# Altium schematic sheet 26 Clock 1.SchDoc
size 297 x 209 mm
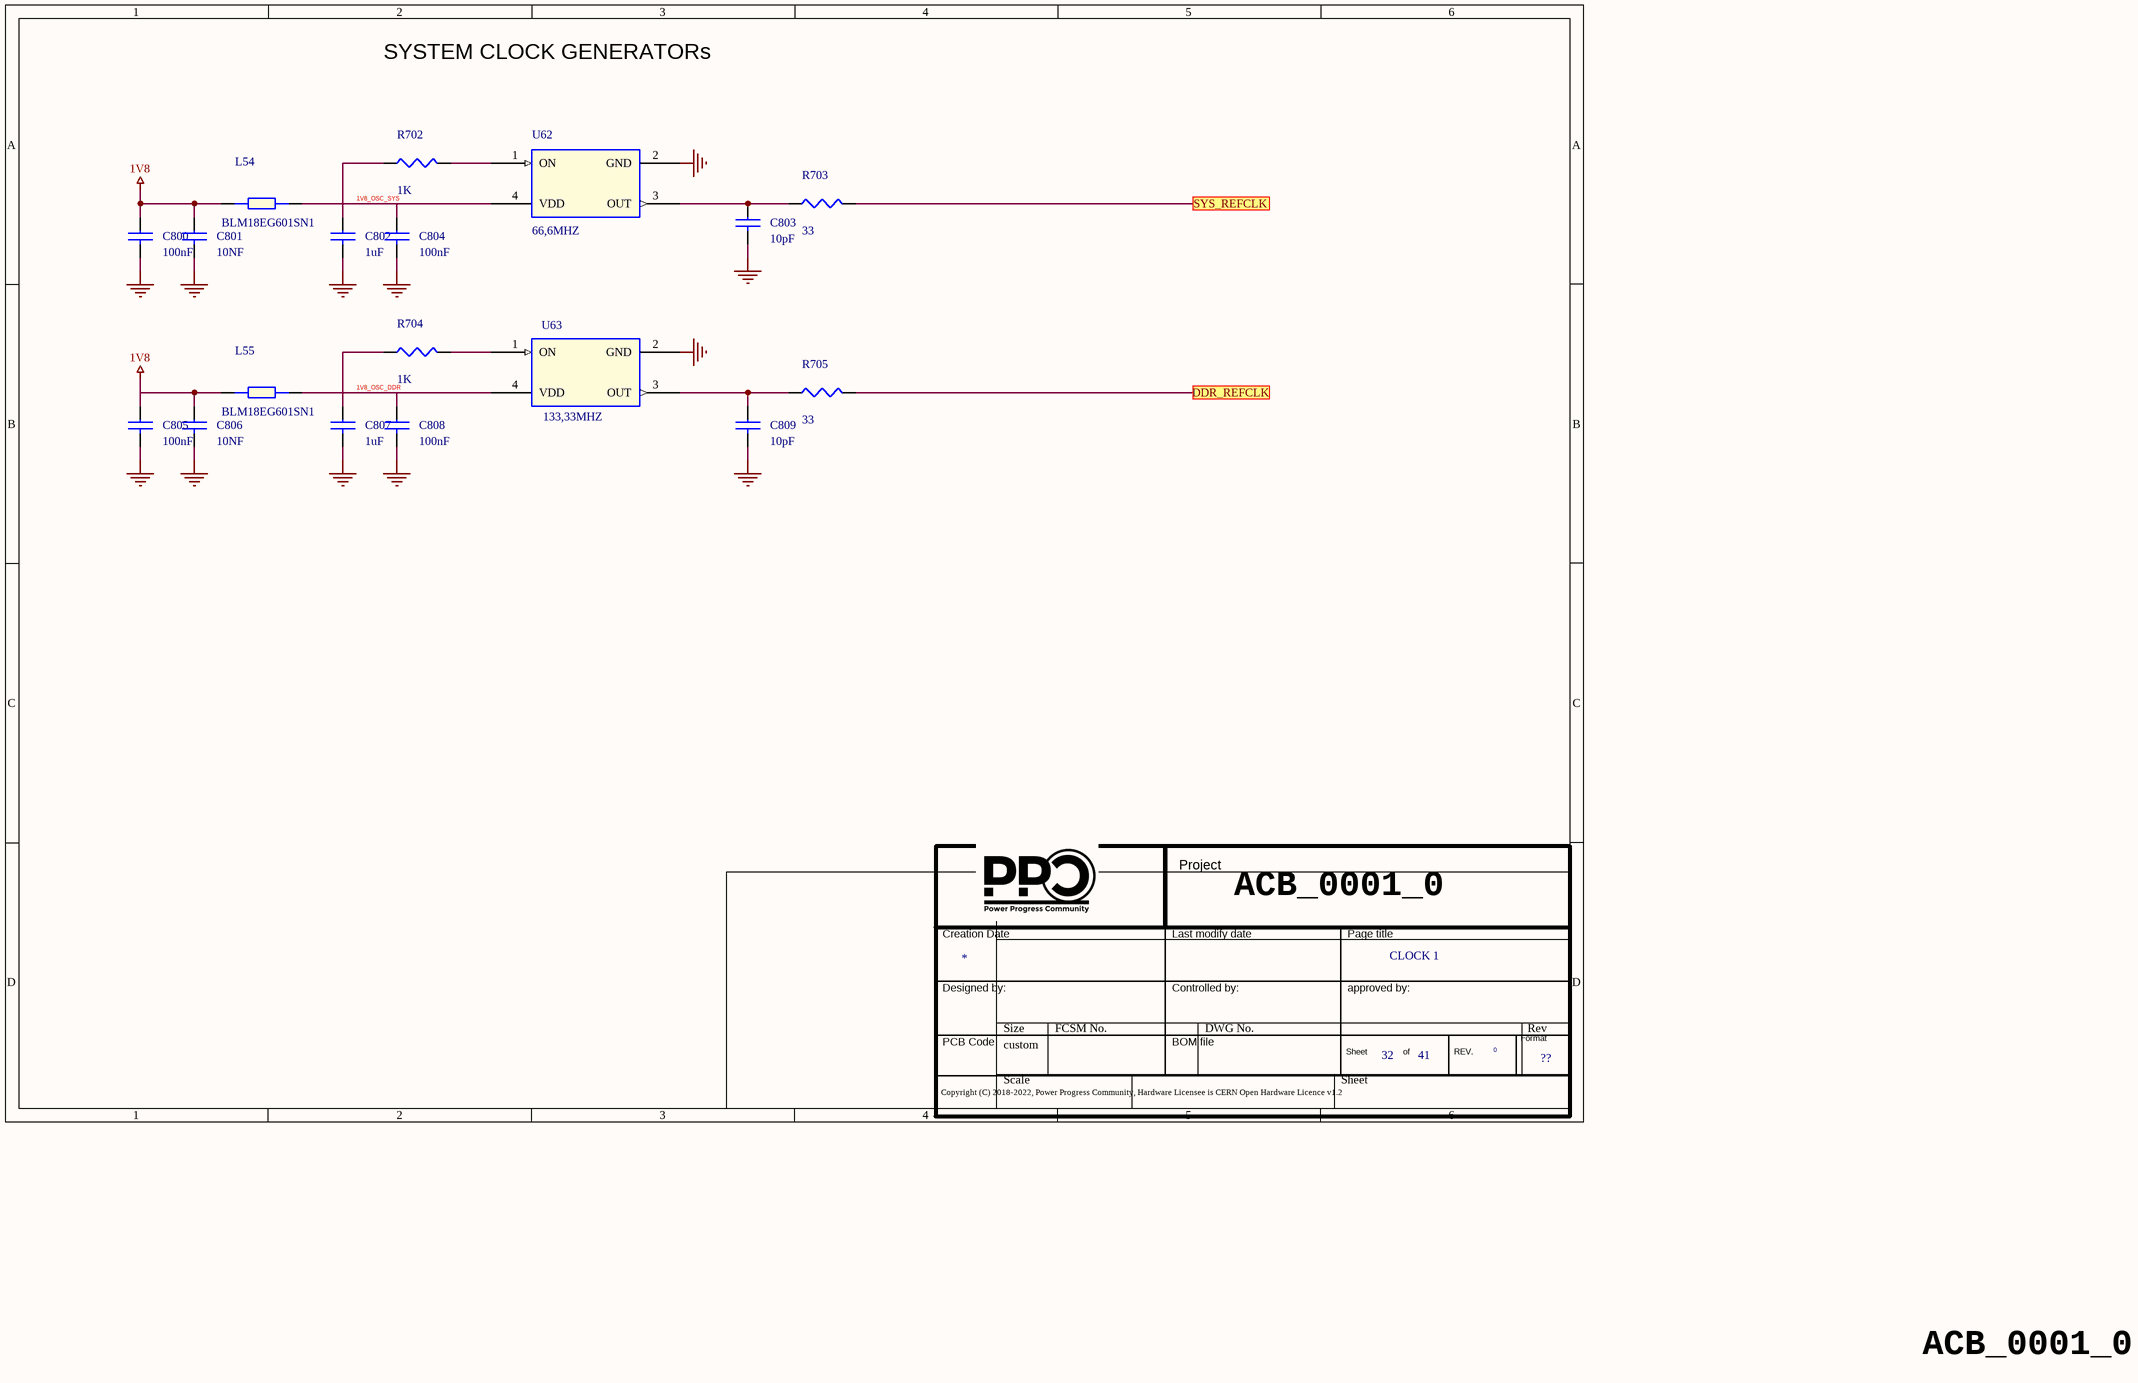
[diagram p0: 26 Clock 1.SchDoc]

## Parts
*  Doc: CLOCK 1  Page Count: 41  Page Number: 32  Page Size: ??  RevCode: 0  (hidden comment: Title_block_PPC)  (graphical)
C800  100nF  [SMD_0402]
C801  10NF  [SMD_0402]
C802  1uF  [SMD_0402]
C803  10pF  [SMD_0402]
C804  100nF  [SMD_0402]
C805  100nF  [SMD_0402]
C806  10NF  [SMD_0402]
C807  1uF  [SMD_0402]
C808  100nF  [SMD_0402]
C809  10pF  [SMD_0402]
L54  BLM18EG601SN1  [SMD_0603]
L55  BLM18EG601SN1  [SMD_0603]
R702  1K  [SMD_0402]
R703  33  [SMD_0402]
R704  1K  [SMD_0402]
R705  33  [SMD_0402]
U62  66,6MHZ  [4 PIN SMT]
U63  133,33MHZ  [4 PIN SMT]

## Ports
DDR_REFCLK, SYS_REFCLK

## Nets
1V8: C800.1 C801.1 C805.1 C806.1 L54.1 L55.1
GND: C800.2 C801.2 C802.2 C803.2 C804.2 C805.2 C806.2 C807.2 C808.2 C809.2 U62.2(GND) U63.2(GND)
1V8_OSC_DDR: C807.1 C808.1 L55.2 R704.1 U63.4(VDD)
1V8_OSC_SYS: C802.1 C804.1 L54.2 R702.1 U62.4(VDD)
DDR_REFCLK: R705.2 ; port DDR_REFCLK
SYS_REFCLK: R703.2 ; port SYS_REFCLK
NetC803_1: C803.1 R703.1 U62.3(OUT)
NetC809_1: C809.1 R705.1 U63.3(OUT)
NetR702_2: R702.2 U62.1(ON)
NetR704_2: R704.2 U63.1(ON)

## Notes on the sheet
- SYSTEM CLOCK GENERATORs
- ACB_0001_0
- (in symbol Title_block_PPC) Project; Creation Date; Last modify date; Page title; Designed by:; Controlled by:; approved by:; PCB Code; BOM file; Format; Sheet; of; REV.; Copyright (C) 2018-2022, Power Progress Community, Hardware Licensee is CERN Open Hardware Licence v1.2

## Library data of the parts
* = Title_block_PPC: Title: T2080PCIe; Author: MICETEK; Page Create Date: March  8, 1995; Page Title: ?; Page Modify Date: *
C800 C804 C805 C808 = CAP NP_Dup3: COND.CER. 100NF 50V 0402 X7R SMD; Part Number: PASSIVE_24; Manufacturer 1: TDK; Manufacturer Part Number 1: CGA2B3X7R1H104M050BD; RSM: RC0402; Part Type: Capacitors\Ceramic\SMD\0402; PCB Footprint: SMD_0402
C801 C806 = CAP NP_Dup3: COND.CER. 10NF 16V 0402 X7R SMD; Part Number: PASSIVE_28; Manufacturer 1: AVX; Manufacturer Part Number 1: 0402YC103KAT2A; RSM: RC0402; Part Type: Capacitors\Ceramic\SMD\0402; PCB Footprint: SMD_0402
C802 C807 = CAP NP_Dup3: CAP CER 1UF 25V X6S 0402; Manufacturer Part Number 1: GRM155C81E105KE11D; Manufacturer 1: Murata; Part Number: PASSIVE_1446; RSM: RC0402; PCB Footprint: SMD_0402; Part Type: Capacitors\Ceramic\SMD\0402
C803 C809 = CAP NP_Dup3: COND.CER.10PF 50V 0402 NPO/COG SMD; Part Number: PASSIVE_32; Manufacturer 1: Murata; Manufacturer Part Number 1: GRM1555C1H100JZ01D; RSM: RC0402; Part Type: Capacitors\Ceramic\SMD\0402; PCB Footprint: SMD_0402
L54 L55 = FERRITE_BEAD: FERRITE BEAD 600ohm 500mA 0603 SMD; Part Number: PASSIVE_377; Manufacturer 1: Murata; Manufacturer Part Number 1: BLM18EG601SN1 SMD; RSM: RC0603; Part Type: Ferrite Beads\SMD\0603; PCB Footprint: SMD_0603
R702 R704 = R_Dup6: RESIS.CHIP 1K 1% 0402 SMD; Part Number: PASSIVE_628; Manufacturer 1: ROYAL OHM; RSM: RC0402; PCB Footprint: SMD_0402; Part Type: Resistors\Fixed\SMD\0402\1%; Manufacturer Part Number 1: RESIS.CHIP 1K 1% 0402 SMD
R703 = R_Dup6: RESIS.CHIP 33R 5% 0402 SMD; Part Number: PASSIVE_853; Manufacturer 1: ROYAL OHM; RSM: RC0402; PCB Footprint: SMD_0402; Part Type: Resistors\Fixed\SMD\0402\5%; Manufacturer Part Number 1: RESIS.CHIP 33R 5% 0402 SMD
R705 = R_Dup6: RESIS.CHIP 33R 5% 0402 SMD; Manufacturer 1: ROYAL OHM; Part Number: PASSIVE_853; RSM: RC0402; PCB Footprint: SMD_0402; Manufacturer Part Number 1: RESIS.CHIP 33R 5% 0402 SMD; Part Type: Resistors\Fixed\SMD\0402\5%
U62 = OSCILLATOR: MEMS OSC XO 66.6600MHZ H/LV-CMOS; Part Number: MISC_268; Manufacturer 1: SiTIME; Manufacturer Part Number 1: SIT1602BC-23-18S-66.660000D; RSM: XC-CTS-632; PCB Footprint: SMD_3.2x2.5; Part Type: Oscillator; Distributor 1: DIGIKEY(1473-SIT1602BC-23-18S-66.660000D-ND)
U63 = OSCILLATOR: MEMS OSC XO 133.3300MHZ LVCMOS; Part Number: MISC_269; Manufacturer 1: SiTIME; Manufacturer Part Number 1: SIT8009AC-12-18E-133.330000E; PCB Footprint: SMD_2.5x2.0; RSM: XC-OSC-NZ2520S; Part Type: Oscillator; Distributor 1: DIGIKEY(1473-SIT8009AC-12-18E-133.330000E-ND)